# Altium schematic sheet Phase Voltage Dividers.SchDoc: 3 Phase Voltage Dividers
size 292 x 193 mm; SheetNumber: 10; SheetTotal: 12
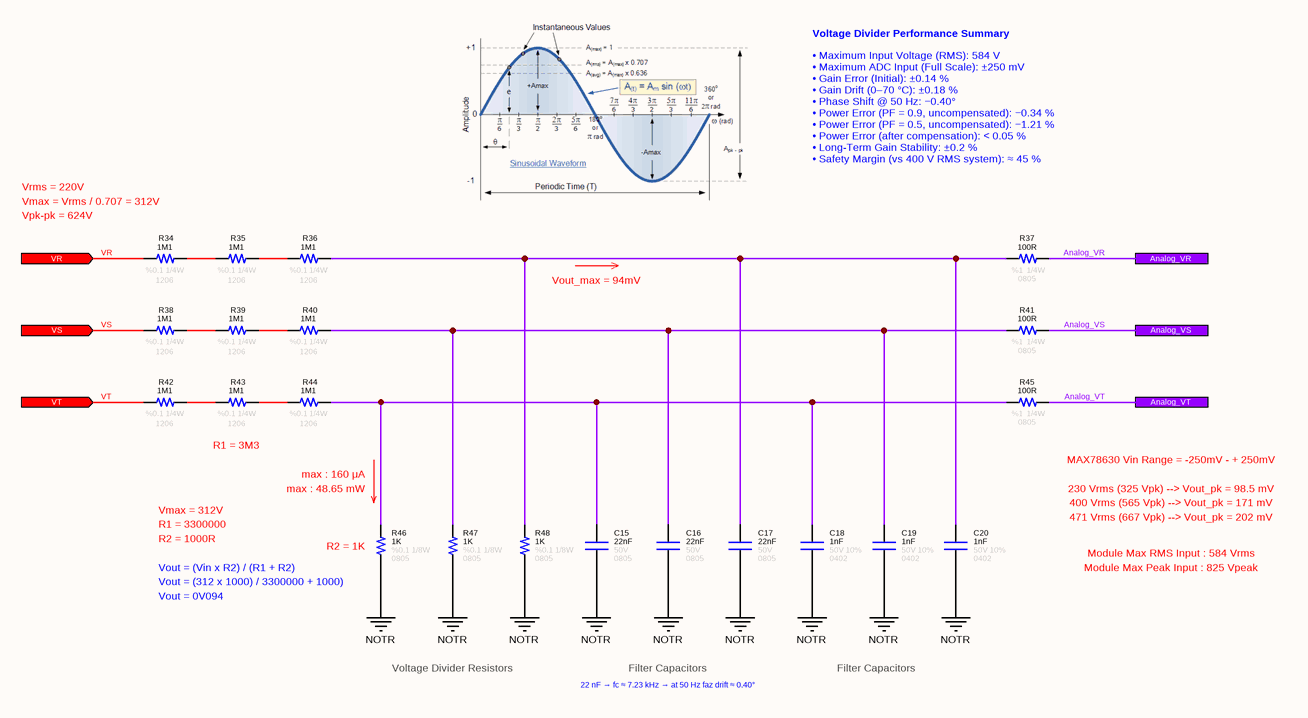
[diagram p0: Phase Voltage Dividers.SchDoc]

## Parts
C15  value 22nF  Case: 0805  Voltage: 50V  [CAPACITOR_0805]  (hidden comment: Capacitor - 22nF [0805] (MLCC))
C16  value 22nF  Case: 0805  Voltage: 50V  [CAPACITOR_0805]  (hidden comment: Capacitor - 22nF [0805] (MLCC))
C17  value 22nF  Case: 0805  Voltage: 50V  [CAPACITOR_0805]  (hidden comment: Capacitor - 22nF [0805] (MLCC))
C18  value 1nF  Tolerance: 10%  Case: 0402  Voltage: 50V  [CAPACITOR_0402]  (hidden comment: Capacitor - 1nF [0402] (MLCC))
C19  value 1nF  Tolerance: 10%  Case: 0402  Voltage: 50V  [CAPACITOR_0402]  (hidden comment: Capacitor - 1nF [0402] (MLCC))
C20  value 1nF  Tolerance: 10%  Case: 0402  Voltage: 50V  [CAPACITOR_0402]  (hidden comment: Capacitor - 1nF [0402] (MLCC))
R34  value 1M1  Case: 1206  Tolerance: %0.1  Power: 1/4W  [RESISTOR_1206]  (hidden comment: 1M1 - 1206 - %1 - 1/4W)
R35  value 1M1  Case: 1206  Tolerance: %0.1  Power: 1/4W  [RESISTOR_1206]  (hidden comment: 1M1 - 1206 - %1 - 1/4W)
R36  value 1M1  Case: 1206  Tolerance: %0.1  Power: 1/4W  [RESISTOR_1206]  (hidden comment: 1M1 - 1206 - %1 - 1/4W)
R37  value 100R  Case: 0805  Tolerance: %1  Power: 1/4W  [RESISTOR_0805]  (hidden comment: 100R - 0805 - %1 - 1/4W)
R38  value 1M1  Case: 1206  Tolerance: %0.1  Power: 1/4W  [RESISTOR_1206]  (hidden comment: 1M1 - 1206 - %1 - 1/4W)
R39  value 1M1  Case: 1206  Tolerance: %0.1  Power: 1/4W  [RESISTOR_1206]  (hidden comment: 1M1 - 1206 - %1 - 1/4W)
R40  value 1M1  Case: 1206  Tolerance: %0.1  Power: 1/4W  [RESISTOR_1206]  (hidden comment: 1M1 - 1206 - %1 - 1/4W)
R41  value 100R  Case: 0805  Tolerance: %1  Power: 1/4W  [RESISTOR_0805]  (hidden comment: 100R - 0805 - %1 - 1/4W)
R42  value 1M1  Case: 1206  Tolerance: %0.1  Power: 1/4W  [RESISTOR_1206]  (hidden comment: 1M1 - 1206 - %1 - 1/4W)
R43  value 1M1  Case: 1206  Tolerance: %0.1  Power: 1/4W  [RESISTOR_1206]  (hidden comment: 1M1 - 1206 - %1 - 1/4W)
R44  value 1M1  Case: 1206  Tolerance: %0.1  Power: 1/4W  [RESISTOR_1206]  (hidden comment: 1M1 - 1206 - %1 - 1/4W)
R45  value 100R  Case: 0805  Tolerance: %1  Power: 1/4W  [RESISTOR_0805]  (hidden comment: 100R - 0805 - %1 - 1/4W)
R46  value 1K  Tolerance: %0.1  Case: 0805  Power: 1/8W  [RESISTOR_0805]  (hidden comment: 1K - 0805 - %0.1 - 1/8W)
R47  value 1K  Tolerance: %0.1  Case: 0805  Power: 1/8W  [RESISTOR_0805]  (hidden comment: 1K - 0805 - %0.1 - 1/8W)
R48  value 1K  Tolerance: %0.1  Case: 0805  Power: 1/8W  [RESISTOR_0805]  (hidden comment: 1K - 0805 - %0.1 - 1/8W)

## Ports
Analog_VR, Analog_VS, Analog_VT, VR (in), VS (in), VT (in)

## Nets
NOTR: C15.1 C16.1 C17.1 C18.1 C19.1 C20.1 R46.1 R47.1 R48.1
Analog_VR: R37.1 ; port Analog_VR
Analog_VS: R41.1 ; port Analog_VS
Analog_VT: R45.1 ; port Analog_VT
VR: R34.2 ; port VR
VS: R38.2 ; port VS
VT: R42.2 ; port VT
NetC15_2: C15.2 C18.2 R44.1 R45.2 R46.2
NetC16_2: C16.2 C19.2 R40.1 R41.2 R47.2
NetC17_2: C17.2 C20.2 R36.1 R37.2 R48.2
NetR34_1: R34.1 R35.2
NetR35_1: R35.1 R36.2
NetR38_1: R38.1 R39.2
NetR39_1: R39.1 R40.2
NetR42_1: R42.1 R43.2
NetR43_1: R43.1 R44.2

## Notes on the sheet
- Voltage Divider Performance Summary
- Vrms = 220V
- (near R34) Vmax = Vrms / 0.707 = 312V
- Vpk-pk = 624V
- • Maximum Input Voltage (RMS): 584 V
  • Maximum ADC Input (Full Scale): ±250 mV
  • Gain Error (Initial): ±0.14 %
  • Gain Drift (0–70 °C): ±0.18 %
  • Phase Shift @ 50 Hz: −0.40°
  • Power Error (PF = 0.9, uncompensated): −0.34 %
  • Power Error (PF = 0.5, uncompensated): −1.21 %
  • Power Error (after compensation): < 0.05 %
  • Long-Term Gain Stability: ±0.2 %
  • Safety Margin (vs 400 V RMS system): ≈ 45 %
- Vout_max = 94mV
- R1 = 3M3
- max : 160 μA
- (near R46) max : 48.65 mW
- MAX78630 Vin Range = -250mV - + 250mV
- 230 Vrms (325 Vpk) --> Vout_pk = 98.5 mV
- 400 Vrms (565 Vpk) --> Vout_pk = 171 mV
- Vout = (Vin x R2) / (R1 + R2)
- Vmax = 312V
- R1 = 3300000
- R2 = 1000R
- (near R46) Vout = (312 x 1000) / 3300000 + 1000)
- (near R46) R2 = 1K
- Module Max RMS Input : 584 Vrms
- Module Max Peak Input : 825 Vpeak
- 471 Vrms (667 Vpk) --> Vout_pk = 202 mV
- Vout = 0V094
- Voltage Divider Resistors
- 22 nF → fc ≈ 7.23 kHz → at 50 Hz faz drift ≈ 0.40°
- Filter Capacitors
- © 2021 All rights reserved.
  This document may not, in whole or in part, be copied, photocopied, reproduced, translated or converted to any electronic or machine readable from without prior written permission of Mehmet Günce Akkoyun.
  Engineer contact : akkoyun@me.com
- Property of
- Engineer :
- Date :
- Size :
- A4
- Time :
- Project :
- Page :
- /
- Customer :
- Product ID :
- Module ID :
- Version :
- File :
- Revision :

## Library data of the parts
C15-C17 = Capacitor - 22nF [0805-50V]: Capacitor (MLCC) - 22nF / 50V / 0805; Manufacturer Name: Yageo; Manufacturer Part Number: C0805C223K5RACTU; Tolerance: 10%; Subcategory: Capacitors
C18-C20 = Capacitor - 1nF [0402-50V]: Capacitor (MLCC) - 1nF / 50V / 0402; Manufacturer Name: Murata; Manufacturer Part Number: GRM155R71H102KA01D; Subcategory: Capacitors
R34-R36 R38-R40 R42-R44 = Resistor - 1M1 [1206] %0.1: Thick Film Resistors - SMD 1/4 W 1.1 MOhm 0.1%; Manufacturer Name: Yageo; Manufacturer Part Number: RT1206BRD071M1L
R37 R41 R45 = Resistor - 100R [0805]: Thick Film Resistors - SMD 1/4 W 100 Ohm 1%; Manufacturer Name: Vishay; Manufacturer Part Number: CRCW0805100RFKEA
R46-R48 = Resistor - 1K [0805]: Thick Film Resistors - SMD 1/8 W 1 KOhm 0.1%; Manufacturer Name: Panasonic; Manufacturer Part Number: ERA-6AEB102V